# EAGLE schematic RowMicro11 (EAGLE 6.4)
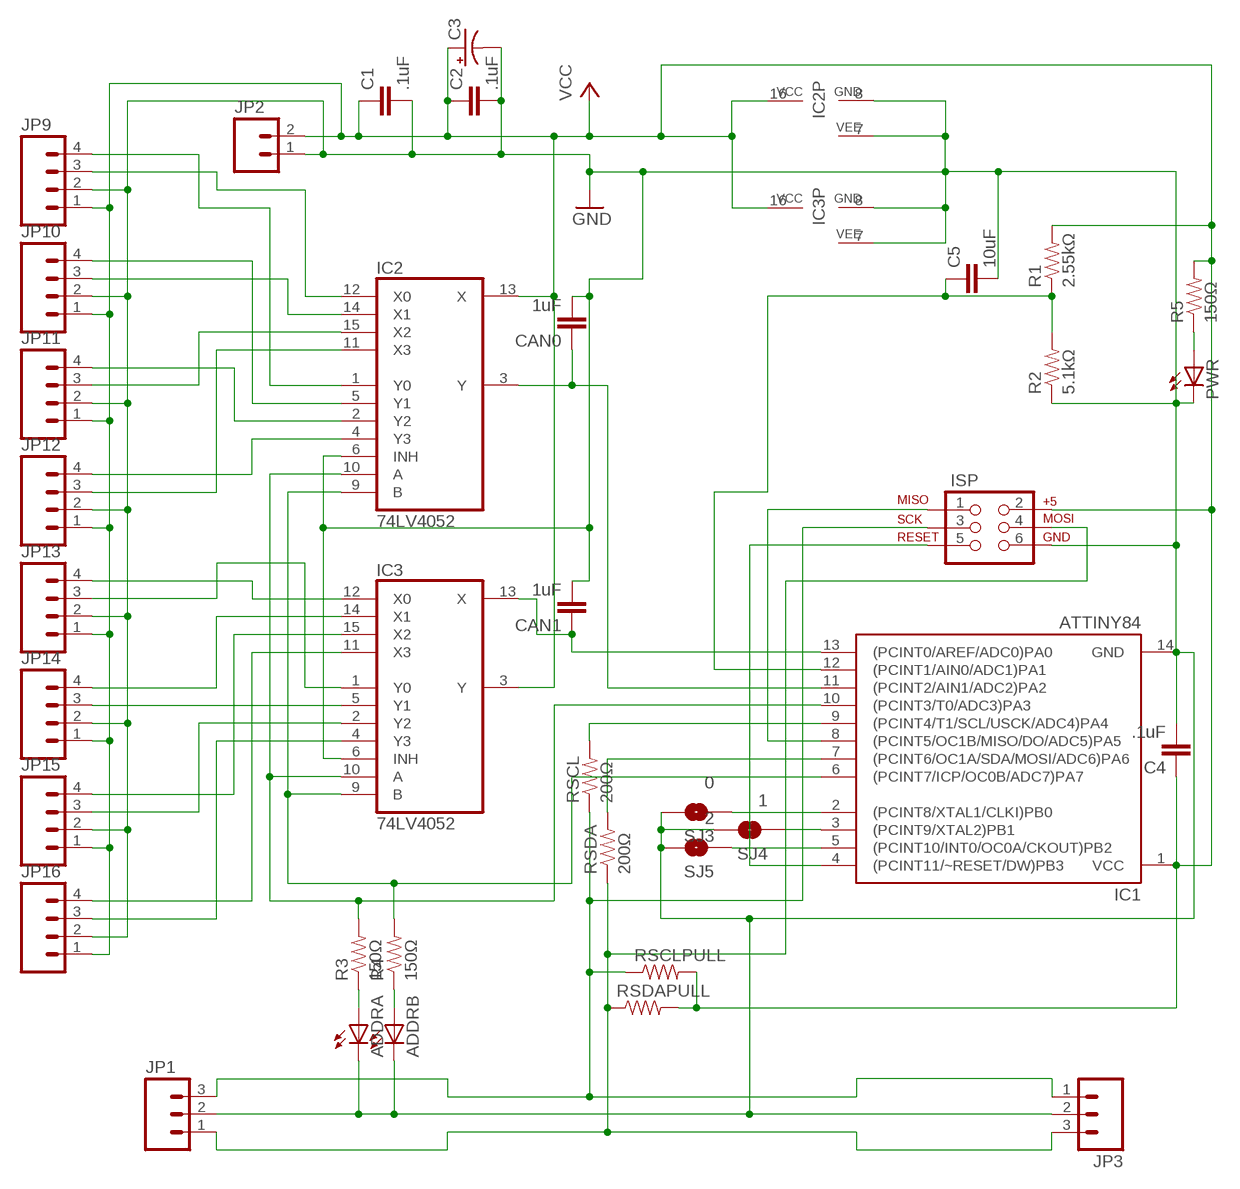
[diagram p0: schematic, sheet 1]

## Parts
ADDRA  LED0603  [LED-0603]
ADDRB  LED0603  [LED-0603]
C1  .1uF  CAP0805  [0805]
C2  .1uF  CAP0805  [0805]
C3  CAP_POLPTH1  [CPOL-RADIAL-100UF-25V]
C4  .1uF  CAP0805  [0805]
C5  10uF  CAP0805  [0805]
CAN0  1uF  CAP0805  [0805]
CAN1  1uF  CAP0805  [0805]
IC1  ATTINY84  [SO14]
IC2  74LV4052  4052AL  [TSSOP16L]
IC3  74LV4052  4052AL  [TSSOP16L]
ISP  AVR_SPI_PRG_62X3_LOCK  [2X3_LOCK]
JP1  M03SCREW  [SCREWTERMINAL-3.5MM-3]
JP2  M02POLAR  [MOLEX-1X2]
JP3  M03SCREW  [SCREWTERMINAL-3.5MM-3]
JP9  M04POLAR  [MOLEX-1X4]
JP10  M04POLAR  [MOLEX-1X4]
JP11  M04POLAR  [MOLEX-1X4]
JP12  M04POLAR  [MOLEX-1X4]
JP13  M04POLAR  [MOLEX-1X4]
JP14  M04POLAR  [MOLEX-1X4]
JP15  M04POLAR  [MOLEX-1X4]
JP16  M04POLAR  [MOLEX-1X4]
PWR  LED0603  [LED-0603]
R1  2.55kΩ  RESISTOR0603-RES  [0603-RES]
R2  5.1kΩ  RESISTOR0603-RES  [0603-RES]
R3  150Ω  RESISTOR0603-RES  [0603-RES]
R4  150Ω  RESISTOR0603-RES  [0603-RES]
R5  150Ω  RESISTOR0603-RES  [0603-RES]
RSCL  200Ω  RESISTOR0603-RES  [0603-RES]
RSCLPULL  RESISTOR0603-RES  [0603-RES]
RSDA  200Ω  RESISTOR0603-RES  [0603-RES]
RSDAPULL  RESISTOR0603-RES  [0603-RES]
SJ3  0  SOLDERJUMPERNO  [SJ_2S-NO]
SJ4  1  SOLDERJUMPERNO  [SJ_2S-NO]
SJ5  2  SOLDERJUMPERNO  [SJ_2S-NO]

## Nets
ADDRA: IC1.10((PCINT3/T0/ADC3)PA3) IC2.10(A) IC3.10(A) R3.2
ADDRB: IC1.6((PCINT7/ICP/OC0B/ADC7)PA7) IC2.9(B) IC3.9(B) R4.2
AIN_L1: IC2.1(Y0) JP9.4
AIN_L2: IC2.5(Y1) JP10.4
AIN_L3: IC2.2(Y2) JP11.4
AIN_L4: IC2.4(Y3) JP12.4
AIN_R1: IC3.12(X0) JP13.4
AIN_R2: IC3.14(X1) JP14.4
AIN_R3: IC3.15(X2) JP15.4
AIN_R4: IC3.11(X3) JP16.4
DOUT_L1: IC2.12(X0) JP9.3
DOUT_L2: IC2.14(X1) JP10.3
DOUT_L3: IC2.15(X2) JP11.3
DOUT_L4: IC2.11(X3) JP12.3
DOUT_R1: IC3.1(Y0) JP13.3
DOUT_R2: IC3.5(Y1) JP14.3
DOUT_R3: IC3.2(Y2) JP15.3
DOUT_R4: IC3.4(Y3) JP16.3
GND: ADDRA.C ADDRB.C C1.2 C2.2 C3.2(-) C4.2 C5.2 CAN0.2 CAN1.2 IC1.14(GND) IC2.6(INH) IC2.7(VEE) IC2.8(GND) IC3.6(INH) IC3.7(VEE) IC3.8(GND) ISP.6 JP1.2 JP2.1 JP3.2 JP9.2 JP10.2 JP11.2 JP12.2 JP13.2 JP14.2 JP15.2 JP16.2 PWR.C R2.1 SJ3.2 SJ4.2 SJ5.2
I2CADDR0: IC1.2((PCINT8/XTAL1/CLKI)PB0) SJ3.1
I2CADDR1: IC1.3((PCINT9/XTAL2)PB1) SJ4.1
I2CADDR2: IC1.5((PCINT10/INT0/OC0A/CKOUT)PB2) SJ5.1
MISO: IC1.8((PCINT5/OC1B/MISO/DO/ADC5)PA5) ISP.1
N$11: ADDRA.A R3.1
N$12: ADDRB.A R4.1
N$13: C5.1 IC1.12((PCINT1/AIN0/ADC1)PA1) R1.1 R2.2
N$20: CAN0.1 IC1.11((PCINT2/AIN1/ADC2)PA2) IC2.3(Y)
N$21: IC1.9((PCINT4/T1/SCL/USCK/ADC4)PA4) RSCL.2
N$22: PWR.A R5.1
N$23: CAN1.1 IC1.13((PCINT0/AREF/ADC0)PA0) IC3.13(X)
N$30: IC1.7((PCINT6/OC1A/SDA/MOSI/ADC6)PA6) RSDA.2
RESET: IC1.4((PCINT11/~RESET/DW)PB3) ISP.5
SCL: ISP.3 JP1.3 JP3.1 RSCL.1 RSCLPULL.1
SDA: ISP.4 JP1.1 JP3.3 RSDA.1 RSDAPULL.1
VCC: C1.1 C2.1 C3.1(+) C4.1 IC1.1(VCC) IC2.13(X) IC2.16(VCC) IC3.3(Y) IC3.16(VCC) ISP.2 JP2.2 JP9.1 JP10.1 JP11.1 JP12.1 JP13.1 JP14.1 JP15.1 JP16.1 R1.2 R5.2 RSCLPULL.2 RSDAPULL.2

## Library data of the parts
ADDRA ADDRB PWR = SparkFun-LED:LED: LEDs Standard schematic elements and footprints for 5mm, 3mm, 1206, and 0603 sized LEDs. 5mm - Spark Fun Electronics SKU : COM-00529 (and others)
C1 C2 C4 C5 CAN0 CAN1 = SparkFun-Capacitors:CAP: Capacitor Standard 0603 ceramic capacitor, and 0.1" leaded capacitor.
C3 = SparkFun-Capacitors:CAP_POL: Capacitor Polarized These are standard SMD and PTH capacitors. Normally 10uF, 47uF, and 100uF in electrolytic and tantalum varieties. Always verify the external diameter of the through hole cap, it varies with capacity, voltage, and manufacturer. The EIA devices should be standard.
IC1 = SparkFun-DigitalIC:ATTINY84: Atmel 14-pin 2/4/8kB flash uC
IC2 IC3 = 40xx:4052: Dual 4-channel ANALOG MULTIPLEXER
ISP = SparkFun-Connectors:AVR_SPI_PRG_6: AVR ISP 6 Pin This is the reduced ISP connector for AVR programming. Common on Arduino. This footprint will take up less PCB space and can be used with a 10-pin to 6-pin adapter such as SKU: BOB-08508
JP1 JP3 = SparkFun-Connectors:M03: Header 3 Standard 3-pin 0.1" header. Use with straight break away headers (SKU : PRT-00116), right angle break away headers (PRT-00553), swiss pins (PRT-00743), machine pins (PRT-00117), and female headers (PRT-00115). Molex polarized connector foot print use with SKU : PRT-08232 with associated crimp pins and housings.
JP2 = SparkFun-Connectors:M02: Header 2 Standard 2-pin 0.1" header. Use with straight break away headers (SKU : PRT-00116), right angle break away headers (PRT-00553), swiss pins (PRT-00743), machine pins (PRT-00117), and female headers (PRT-00115). Molex polarized connector foot print use with SKU : PRT-08233 with associated crimp pins and housings.
JP9-JP16 = SparkFun-Connectors:M04: Header 4 Standard 4-pin 0.1" header. Use with straight break away headers (SKU : PRT-00116), right angle break away headers (PRT-00553), swiss pins (PRT-00743), machine pins (PRT-00117), and female headers (PRT-00115). Molex polarized connector foot print use with SKU : PRT-08231 with associated crimp pins and housings. 1MM SMD Version SKU: PRT-10208
R1-R5 RSCL RSCLPULL RSDA RSDAPULL = SparkFun-Passives:RESISTOR: Resistor Basic schematic elements and footprints for 0603, 1206, and PTH resistors.
SJ3-SJ5 = SparkFun-Passives:SOLDERJUMPER: Solder Jumper Standard SMD solder jumper. Used to automate production. Two varients : Normally Open and Normally Closed are the same, but have different paste layers. NC will have a large amount of paste and should jumper during reflow.